# EAGLE schematic MadHaddr (EAGLE 8.3.2)
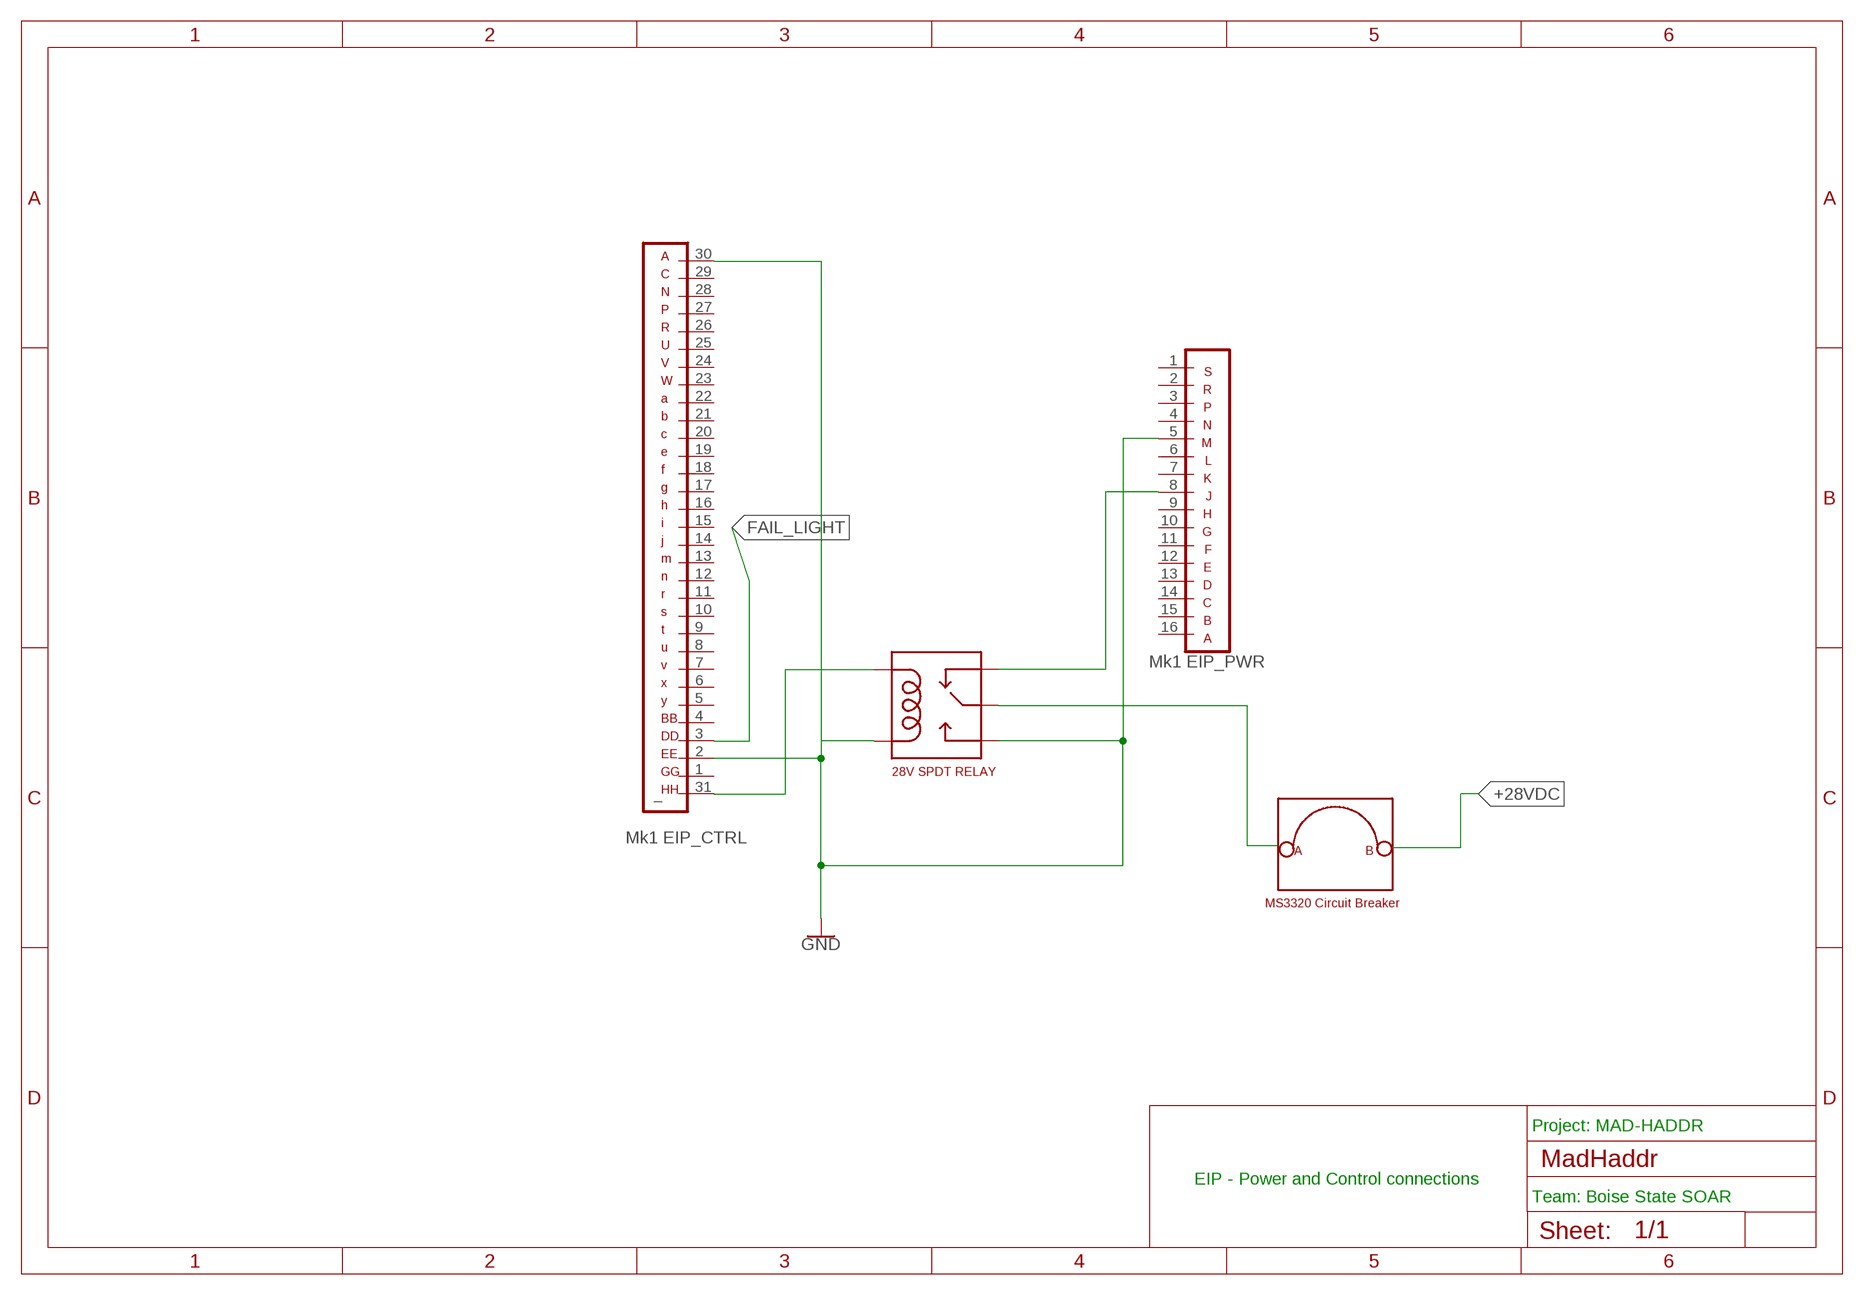
[diagram p0: schematic, sheet 1]

## Parts
J2  SDGDSGG  [1X30]
U$1  MK1_EIP_PWR  [1X16]
U$2  BREAKER  [BREAKER]
U$3  SPDT_RELAY  [RELAY-JZC]

## Nets
+28VDC: U$2.P$1
FAIL_LIGHT: J2.3
GND: J2.2 J2.30 U$1.5 U$3.2(COIL2) U$3.5(NO)
N$1: J2.31(_) U$3.1(COIL1)
N$2: U$1.8 U$3.4(NC)
N$3: U$2.P$2 U$3.3(MAIN)
Unconnected: J2.1 J2.4 J2.5 J2.6 J2.7 J2.8 J2.9 J2.10 J2.11 J2.12 J2.13 J2.14 J2.15 J2.16 J2.17 J2.18 J2.19 J2.20 J2.21 J2.22 J2.23 J2.24 J2.25 J2.26 J2.27 J2.28 J2.29 U$1.1 U$1.2 U$1.3 U$1.4 U$1.6 U$1.7 U$1.9 U$1.10 U$1.11 U$1.12 U$1.13 U$1.14 U$1.15 U$1.16

## Notes on the sheet
- Project: MAD-HADDR
- EIP - Power and Control connections
- Team: Boise State SOAR

## Library data of the parts
J2 = madHaddr:SDGDSGG
U$1 = madHaddr:MK1_EIP_PWR
U$2 = madHaddr:BREAKER
U$3 = madHaddr:SPDT_RELAY